# Altium project Capstone.PrjPcb
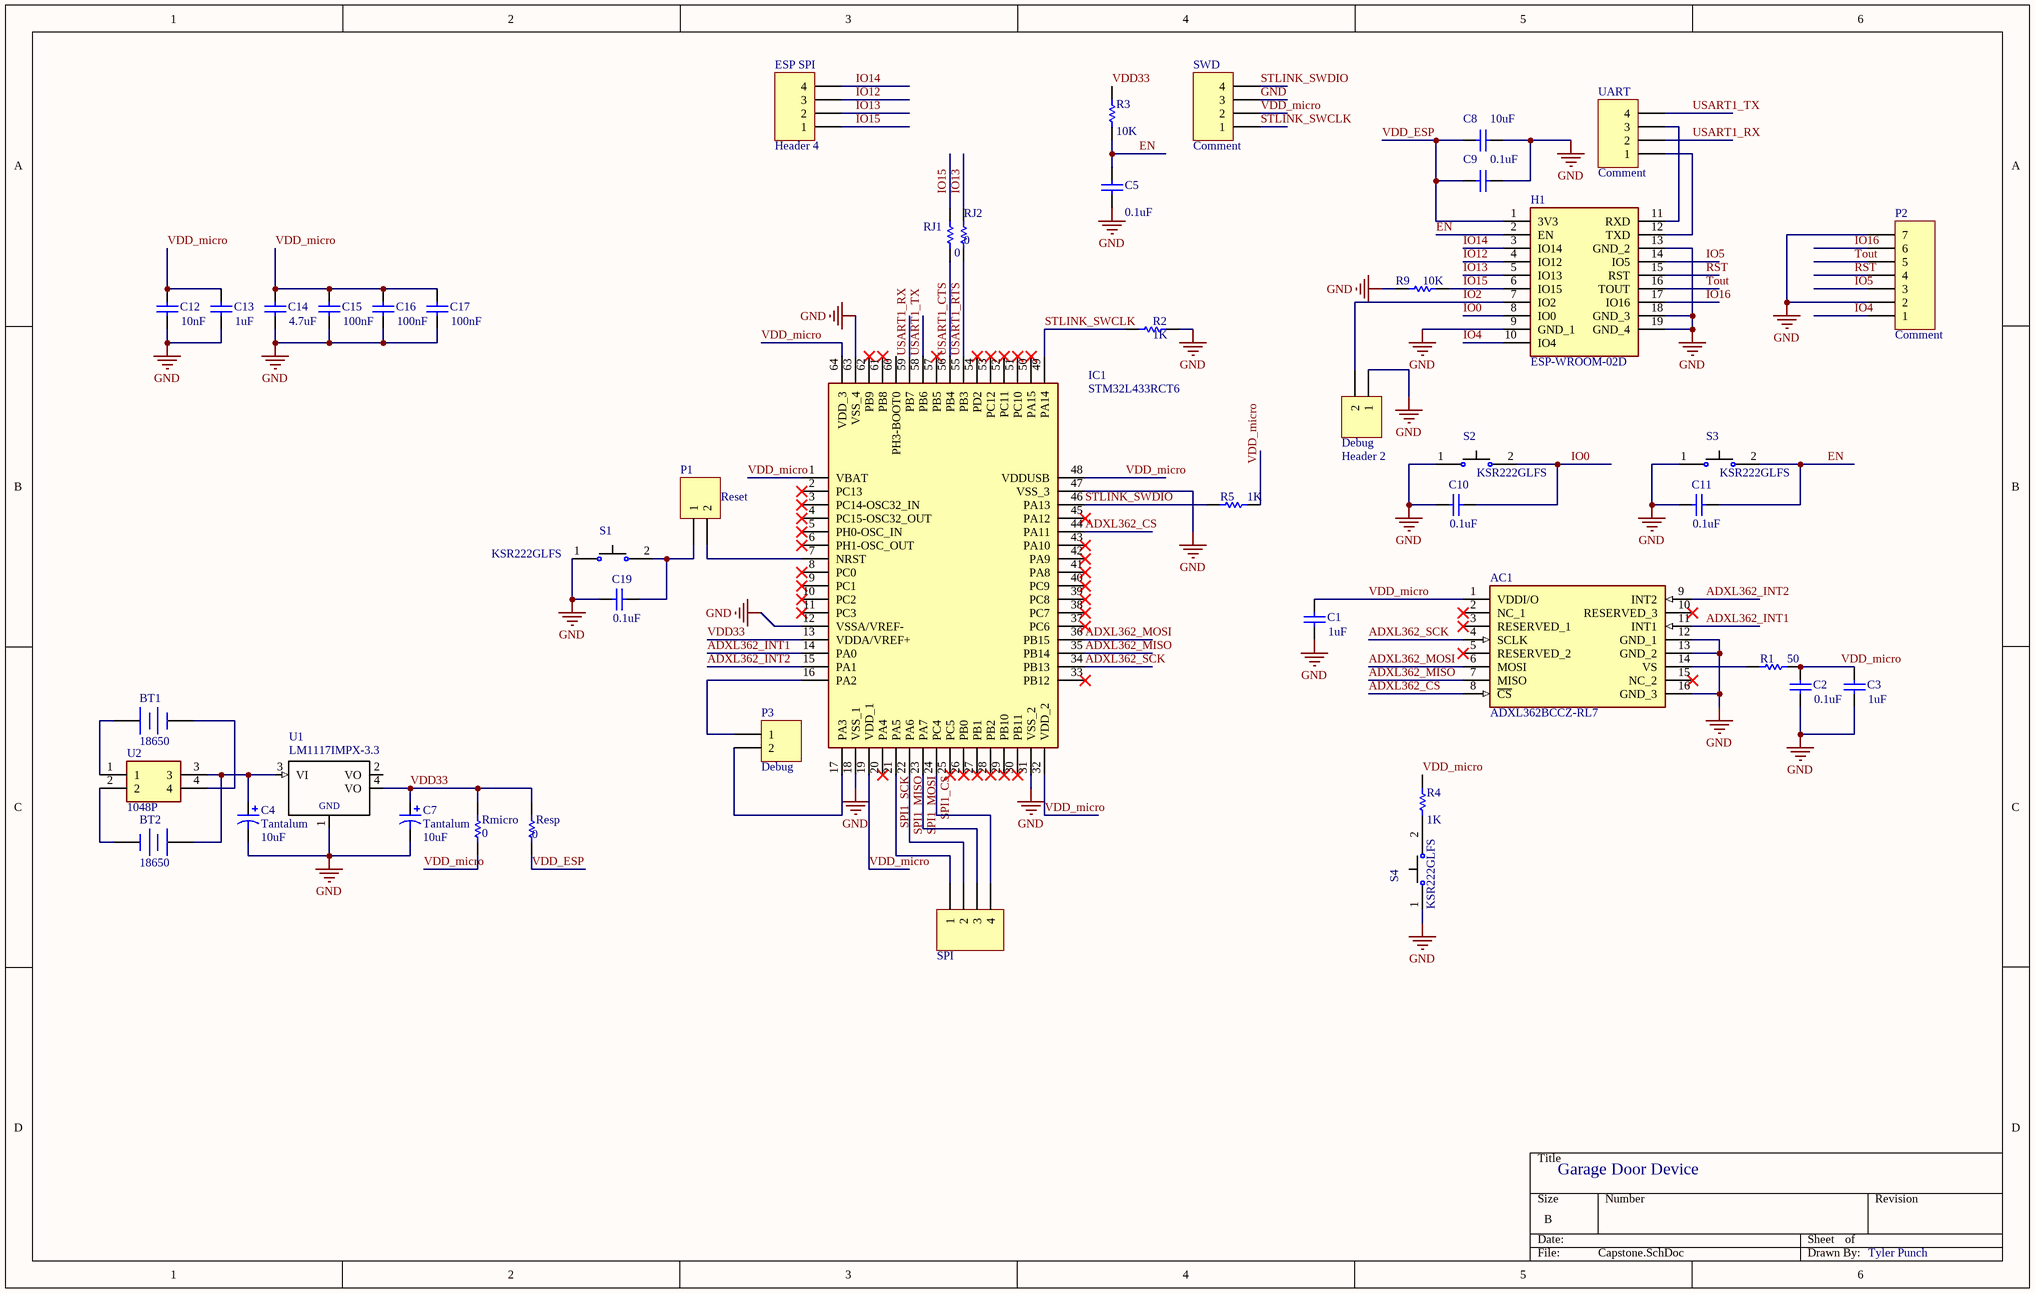
[diagram p0: Capstone.SchDoc]
1 sheet, 46 parts. Net scope: global (net labels, ports and power ports of the same name join across sheets).
Board file: Capstone.PcbDoc

## Sheet Capstone.SchDoc
size B

### Parts
AC1  ADXL362BCCZ-RL7  [CC-16-4]
BT1  18650  [BAT-2]
BT2  18650  [BAT-2]
C1  value 1uF  [*CAPC2012X88N]  (hidden comment: Cap)
C2  value 0.1uF  [*CAPC2012X88N]  (hidden comment: Cap)
C3  value 1uF  [*CAPC2012X88N]  (hidden comment: Cap)
C4  Tantalum  value 10uF  [C1206]
C5  value 0.1uF  [*CAPC2012X88N]  (hidden comment: Cap)
C7  Tantalum  value 10uF  [C1206]
C8  value 10uF  [*CAPC2012X88N]  (hidden comment: Cap)
C9  value 0.1uF  [*CAPC2012X88N]  (hidden comment: Cap)
C10  value 0.1uF  [*CAPC2012X88N]  (hidden comment: Cap)
C11  value 0.1uF  [*CAPC2012X88N]  (hidden comment: Cap)
C12  value 10nF  [*CAPC2012X88N]  (hidden comment: Cap)
C13  value 1uF  [*CAPC2012X88N]  (hidden comment: Cap)
C14  value 4.7uF  [*CAPC2012X88N]  (hidden comment: Cap)
C15  value 100nF  [*CAPC2012X88N]  (hidden comment: Cap)
C16  value 100nF  [*CAPC2012X88N]  (hidden comment: Cap)
C17  value 100nF  [*CAPC2012X88N]  (hidden comment: Cap)
C19  value 0.1uF  [*CAPC2012X88N]  (hidden comment: Cap)
Debug  Header 2  [HDR1X2]
ESP_SPI  Header 4  [HDR1X4]
H1  ESP-WROOM-02D  [ESPWROOM02D]
IC1  STM32L433RCT6  [QFP50P1200X1200X160-64N]
P1  Reset  [HDR1X2]
P2  Comment  [HDR1X7]
P3  Debug  [HDR1X2]
R1  value 50  [RES_WSC_2515]  (hidden comment: Res1)
R2  value 1K  [6-0805_N]  (hidden comment: Res1)
R3  value 10K  [6-0805_N]  (hidden comment: Res1)
R4  value 1K  [AXIAL-0.3]  (hidden comment: Res1)
R5  value 1K  [6-0805_N]  (hidden comment: Res1)
R9  value 10K  [6-0805_N]  (hidden comment: Res1)
Resp  value 0  [6-0805_N]  (hidden comment: Comment)
RJ1  value 0  [AXIAL-0.3]  (hidden comment: Res1)
RJ2  value 0  [AXIAL-0.3]  (hidden comment: Res1)
Rmicro  value 0  [6-0805_N]  (hidden comment: Comment)
S1  KSR222GLFS  [*SW_KSR223GLFG]
S2  KSR222GLFS  [*SW_KSR223GLFG]
S3  KSR222GLFS  [*SW_KSR223GLFG]
S4  KSR222GLFS  [*SW_KSR223GLFG]
SPI  (no value)  [HDR1X4]
SWD  Comment  [HDR1X4]
U1  LM1117IMPX-3.3  [*SOT230P700X180-4N]
U2  1048P  [1048P]
UART  Comment  [HDR1X4]

### Nets
GND: AC1.12(GND_1) AC1.13(GND_2) AC1.16(GND_3) C1.2 C2.1 C3.2 C4.2 C5.2 C7.2 C8.2 C9.2 C10.1 C11.1 C12.1 C13.1 C14.1 C15.1 C16.1 C17.1 C19.1 Debug.1 H1.9(GND_1) H1.13(GND_2) H1.18(GND_3) H1.19(GND_4) IC1.12(VSSA/VREF-) IC1.18(VSS_1) IC1.31(VSS_2) IC1.47(VSS_3) IC1.63(VSS_4) P2.2 P2.7 R2.2 R9.1 S1.1 S2.1 S3.1 S4.1 SWD.3 U1.1(GND)
ADXL362_CS: AC1.8(~{CS}) IC1.44(PA11)
ADXL362_INT1: AC1.11(INT1) IC1.14(PA0)
ADXL362_INT2: AC1.9(INT2) IC1.15(PA1)
ADXL362_MISO: AC1.7(MISO) IC1.35(PB14)
ADXL362_MOSI: AC1.6(MOSI) IC1.36(PB15)
ADXL362_SCK: AC1.4(SCLK) IC1.34(PB13)
EN: C5.1 C11.2 H1.2(EN) R3.2 S3.2
IO0: C10.2 H1.8(IO0) S2.2
IO2: Debug.2 H1.7(IO2)
IO4: H1.10(IO4) P2.1
IO5: H1.14(IO5) P2.3
IO12: ESP_SPI.3 H1.4(IO12)
IO13: ESP_SPI.2 H1.5(IO13) RJ2.2
IO14: ESP_SPI.4 H1.3(IO14)
IO15: ESP_SPI.1 H1.6(IO15) R9.2 RJ1.2
IO16: H1.17(IO16) P2.6
RST: H1.15(RST) P2.4
SPI1_CS: IC1.24(PC4) SPI.4
SPI1_MISO: IC1.22(PA6) SPI.2
SPI1_MOSI: IC1.23(PA7) SPI.3
SPI1_SCK: IC1.21(PA5) SPI.1
STLINK_SWCLK: IC1.49(PA14) R2.1 SWD.1
STLINK_SWDIO: IC1.46(PA13) R5.1 SWD.4
Tout: H1.16(TOUT) P2.5
USART1_CTS: IC1.56(PB4) RJ1.1
USART1_RTS: IC1.55(PB3) RJ2.1
USART1_RX: IC1.59(PB7) UART.2
USART1_TX: IC1.58(PB6) UART.4
VDD33: C7.1 IC1.13(VDDA/VREF+) R3.1 Resp.2 Rmicro.1 U1.4(VO)
VDD_ESP: C8.1 C9.1 H1.1(3V3) Resp.1
VDD_micro: AC1.1(VDDI/O) C1.1 C2.2 C3.1 C12.2 C13.2 C14.2 C15.2 C16.2 C17.2 IC1.1(VBAT) IC1.19(VDD_1) IC1.32(VDD_2) IC1.48(VDDUSB) IC1.64(VDD_3) R1.2 R4.2 R5.2 Rmicro.2 SWD.2
NetAC1_14: AC1.14(VS) R1.1
NetBT1_1: BT1.1(+) U2.1
NetBT1_2: BT1.2(-) U2.4
NetBT2_1: BT2.1(+) C4.1 U1.3(VI) U2.3
NetBT2_2: BT2.2(-) U2.2
NetC19_2: C19.2 P1.1 S1.2
NetH1_11: H1.11(RXD) UART.3
NetH1_12: H1.12(TXD) UART.1
NetIC1_7: IC1.7(NRST) P1.2
NetIC1_16: IC1.16(PA2) P3.1
NetIC1_17: IC1.17(PA3) P3.2
NetR4_1: R4.1 S4.2

Not connected (* = marked no-connect by the designer): AC1 2(NC_1)* 3(RESERVED_1)* 5(RESERVED_2)* 10(RESERVED_3)* 15(NC_2)*; IC1 2(PC13)* 3(PC14-OSC32_IN)* 4(PC15-OSC32_OUT)* 5(PH0-OSC_IN)* 6(PH1-OSC_OUT)* 8(PC0)* 9(PC1)* 10(PC2)* 11(PC3)* 20(PA4)* 25(PC5)* 26(PB0)* 27(PB1)* 28(PB2)* 29(PB10)* 30(PB11)* 33(PB12)* 37(PC6)* 38(PC7)* 39(PC8)* 40(PC9)* 41(PA8)* 42(PA9)* 43(PA10)* 45(PA12)* 50(PA15)* 51(PC10)* 52(PC11)* 53(PC12)* 54(PD2)* 57(PB5)* 60(PH3-BOOT0) 61(PB8)* 62(PB9)*; U1 2(VO)

### Notes on the sheet
- Garage Door Device
- Tyler Punch

### Library data of the parts
AC1 = ADXL362BCCZ-RL7: Accelerometer; Manufacturer_Name: Analog Devices; Datasheet Link: http://www.analog.com/media/en/technical-documentation/data-sheets/ADXL362.pdf; Manufacturer_Part_Number: ADXL362BCCZ-RL7; Mouser Part Number: 584-ADXL362BCCZ-R7; Mouser Price/Stock: https://www.mouser.com/Search/Refine.aspx?Keyword=584-ADXL362BCCZ-R7
BT1 BT2 = Battery: Multicell Battery; Published: 24-Mar-1999; LatestRevisionDate: 17-Jul-2002; LatestRevisionNote: Re-released for DXP Platform.; PackageReference: BAT-2; Publisher: Altium Limited; PackageDescription: Battery; 2 Leads
C1-C3 C5 C8-C17 C19 = Cap: Capacitor; Published: 8-Jun-2000; LatestRevisionDate: 17-Jul-2002; LatestRevisionNote: Re-released for DXP Platform.; PackageReference: RAD-0.3; Publisher: Altium Limited; PackageDescription: Radial Cap, Thru-Hole; 2 Leads; 0.3 in Pin Spacing
C4 C7 = Cap Pol1: Polarized Capacitor (Radial); Published: 8-Jun-2000; LatestRevisionDate: 17-Jul-2002; LatestRevisionNote: Re-released for DXP Platform.; PackageReference: RB7.6-15; Publisher: Altium Limited; PackageDescription: Polarized Capacitor (Radial); 2 Leads
Debug P1 P3 = Header 2: Header, 2-Pin; LatestRevisionDate: 17-Jul-2002; LatestRevisionNote: Re-released for DXP Platform.; Publisher: Altium Limited
ESP_SPI SPI SWD UART = Header 4: Header, 4-Pin; LatestRevisionDate: 17-Jul-2002; LatestRevisionNote: Re-released for DXP Platform.; Publisher: Altium Limited
H1 = ESP-WROOM-02D: Hardware; Manufacturer_Name: Espressif; Datasheet Link: https://br.mouser.com/datasheet/2/891/esp-wroom-02d_esp-wroom-02u_datasheet_en-1365835.pdf; Height: 3.2mm; Manufacturer_Part_Number: ESP-WROOM-02D; Mouser Part Number: 356-ESPWROOM-02D
IC1 = STM32L433RCT6: Integrated Circuit; Manufacturer_Name: STMicroelectronics; Datasheet Link: https://www.st.com/resource/en/datasheet/stm32l433rc.pdf; Height: 1.6mm; Manufacturer_Part_Number: STM32L433RCT6; Mouser Part Number: 511-STM32L433RCT6; Mouser Price/Stock: https://www.mouser.com/Search/Refine.aspx?Keyword=511-STM32L433RCT6
P2 = Header 7: Header, 7-Pin; LatestRevisionDate: 17-Jul-2002; LatestRevisionNote: Re-released for DXP Platform.; Publisher: Altium Limited
R1-R5 R9 Resp RJ1 RJ2 Rmicro = Res1: Resistor; Published: 8-Jun-2000; LatestRevisionDate: 17-Jul-2002; LatestRevisionNote: Re-released for DXP Platform.; PackageReference: AXIAL-0.3; Publisher: Altium Limited; PackageDescription: Axial Device, Thru-Hole; 2 Leads; 0.3 in Pin Spacing
S1-S4 = KSR223GLFG: Switch Tactile N.O. SPST Round Button Gull Wing 0.01A 32VDC 0.2VA 200000Cycles 2N SMD Automotive T/R; MF: C&K; Package: None; Digi-Key_Purchase_URL: https://www.digikey.com/product-detail/en/c-k/KSR223GLFG/401-1704-1-ND/958078?utm_source=snapeda&utm_medium=aggregator&utm_campaign=symbol; SnapEDA_Link: https://www.snapeda.com/parts/KSR223GLFG/C%26K/view-part/?ref=snap; MP: KSR223GLFG; Digi-Key_Part_Number: 401-1704-1-ND; Value: *
U1 = LM1117MPX-3.3: Linear Regulator, Fix, 3.3v, 800ma, Sot-223-4, Full Reel; MP: LM1117MPX-3.3/NOPB; MF: Texas Instruments; Digi-Key_Purchase_URL: https://www.digikey.com/product-detail/en/texas-instruments/LM1117MPX-3.3-NOPB/LM1117MPX-3.3-NOPBCT-ND/1010516?utm_source=snapeda&utm_medium=aggregator&utm_campaign=symbol; Package: SOT-223-4 Texas Instruments; SnapEDA_Link: https://www.snapeda.com/parts/LM1117MPX-3.3/NOPB/Texas%20Instruments/view-part/?ref=snap; Digi-Key_Part_Number: LM1117MPX-3.3/NOPBCT-ND; Value: *
U2 = 1048P: Undefined or Miscellaneous; Manufacturer_Name: Keystone Electronics; Allied_Number: 71135190; Datasheet Link: http://www.keyelco.com/product-pdf.cfm?p=13959; Manufacturer_Part_Number: 1048P; Mouser Part Number: 534-1048P; Mouser Price/Stock: https://www.mouser.com/Search/Refine.aspx?Keyword=534-1048P; Allied Price/Stock: https://www.alliedelec.com/keystone-electronics-1048p/71135190/